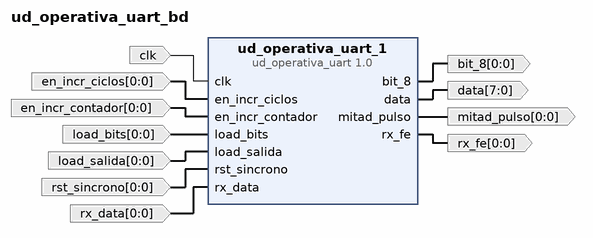
[diagram p0: block diagram of the top level]
# Vivado block design ud_operativa_uart_bd, xc7a100tcsg324-1, Vivado 2023.2
create_bd_design ud_operativa_uart_bd

create_bd_port -dir O -from 0 -to 0 -type data bit_8
create_bd_port -dir I -type clk clk
create_bd_port -dir O -from 7 -to 0 -type data data
create_bd_port -dir I -from 0 -to 0 -type data en_incr_ciclos
create_bd_port -dir I -from 0 -to 0 -type data en_incr_contador
create_bd_port -dir I -from 0 -to 0 -type data load_bits
create_bd_port -dir I -from 0 -to 0 -type data load_salida
create_bd_port -dir O -from 0 -to 0 -type data mitad_pulso
create_bd_port -dir I -from 0 -to 0 -type data rst_sincrono
create_bd_port -dir I -from 0 -to 0 -type data rx_data
create_bd_port -dir O -from 0 -to 0 -type data rx_fe

create_bd_cell -type ip -vlnv User_Company:VMC:ud_operativa_uart:1.0 ud_operativa_uart_1

# ---- connections ----

connect_bd_net [get_bd_ports clk] [get_bd_pins ud_operativa_uart_1/clk]
connect_bd_net [get_bd_ports en_incr_ciclos] [get_bd_pins ud_operativa_uart_1/en_incr_ciclos]
connect_bd_net [get_bd_ports en_incr_contador] [get_bd_pins ud_operativa_uart_1/en_incr_contador]
connect_bd_net [get_bd_ports load_bits] [get_bd_pins ud_operativa_uart_1/load_bits]
connect_bd_net [get_bd_ports load_salida] [get_bd_pins ud_operativa_uart_1/load_salida]
connect_bd_net [get_bd_ports rst_sincrono] [get_bd_pins ud_operativa_uart_1/rst_sincrono]
connect_bd_net [get_bd_ports rx_data] [get_bd_pins ud_operativa_uart_1/rx_data]
connect_bd_net [get_bd_pins ud_operativa_uart_1/bit_8] [get_bd_ports bit_8]
connect_bd_net [get_bd_pins ud_operativa_uart_1/data] [get_bd_ports data]
connect_bd_net [get_bd_pins ud_operativa_uart_1/mitad_pulso] [get_bd_ports mitad_pulso]
connect_bd_net [get_bd_pins ud_operativa_uart_1/rx_fe] [get_bd_ports rx_fe]

validate_bd_design
save_bd_design
